# EAGLE schematic ultrasonic_anemometer_pcb (EAGLE 7.7.0)
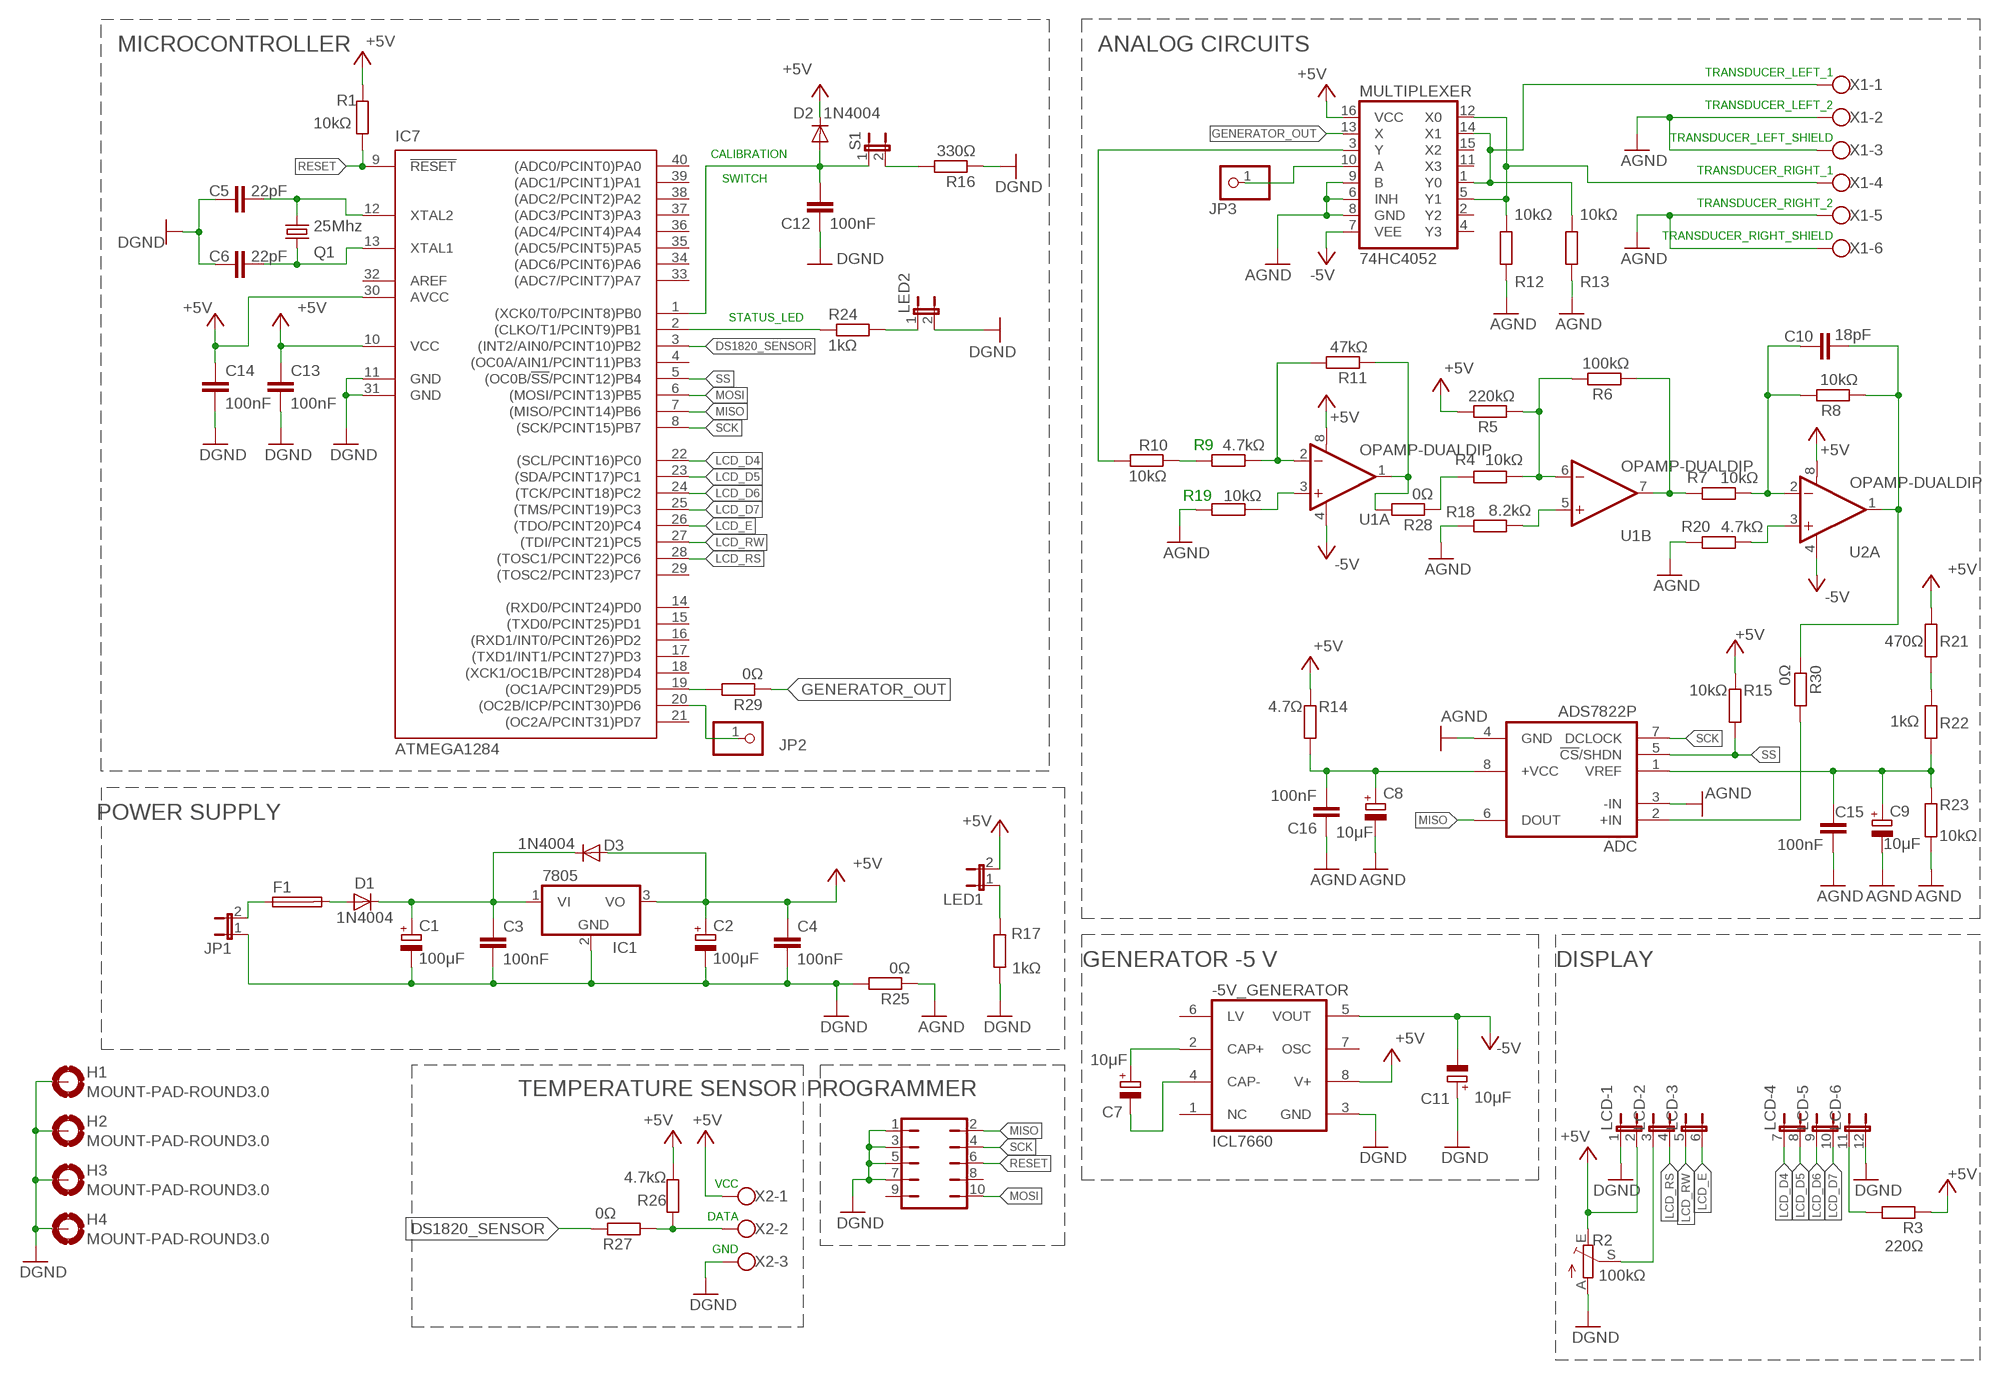
[diagram p0: schematic, sheet 1]

## Parts
-5V_GENERATOR  ICL7660  ICL7660CPA  [DIL08]
ADC  ADS7822P  ADS7816P  [DIL08]
C1  100μF  CPOL-EUE2.5-5  [E2,5-5]
C2  100μF  CPOL-EUE2.5-5  [E2,5-5]
C3  100nF  C-EU025-025X050  [C025-025X050]
C4  100nF  C-EU025-025X050  [C025-025X050]
C5  22pF  C-EU050-024X044  [C050-024X044]
C6  22pF  C-EU050-024X044  [C050-024X044]
C7  10μF  CPOL-EUE2.5-5  [E2,5-5]
C8  10μF  CPOL-EUE2.5-5  [E2,5-5]
C9  10μF  CPOL-EUE2.5-5  [E2,5-5]
C10  18pF  C-EU050-024X044  [C050-024X044]
C11  10μF  CPOL-EUE2.5-5  [E2,5-5]
C12  100nF  C-EU025-025X050  [C025-025X050]
C13  100nF  C-EU025-025X050  [C025-025X050]
C14  100nF  C-EU025-025X050  [C025-025X050]
C15  100nF  C-EU025-025X050  [C025-025X050]
C16  100nF  C-EU025-025X050  [C025-025X050]
D1  1N4004  [DO41-10]
D2  1N4004  [DO41-10]
D3  1N4004  [DO41-10]
F1  SH22,5A  [SH22,5A]
H1  MOUNT-PAD-ROUND3.0  [3,0-PAD]
H2  MOUNT-PAD-ROUND3.0  [3,0-PAD]
H3  MOUNT-PAD-ROUND3.0  [3,0-PAD]
H4  MOUNT-PAD-ROUND3.0  [3,0-PAD]
IC1  7805  7805TV  [TO220V]
IC7  ATMEGA1284  MEGA164P/324P/644P-PU  [DIL40]
JP1  JP1E  [JP1]
JP2  PINHD-1X1  [1X01]
JP3  PINHD-1X1  [1X01]
LCD  JP6QE  [JP6Q]
LED1  JP1E  [JP1]
LED2  JP1E  [JP1]
MULTIPLEXER  74HC4052  74HC4052DIP  [DIL16]
PROGRAMMER  JP5Q  [JP5Q]
Q1  25Mhz  CRYSTALHC49S  [HC49/S]
R1  10kΩ  R-EU_0207/10  [0207/10]
R2  100kΩ  TRIM_EU-CA6V  [CA6V]
R3  220Ω  R-EU_0207/10  [0207/10]
R4  10kΩ  R-EU_0207/10  [0207/10]
R5  220kΩ  R-EU_0207/10  [0207/10]
R6  100kΩ  R-EU_0207/10  [0207/10]
R7  10kΩ  R-EU_0207/10  [0207/10]
R8  10kΩ  R-EU_0207/10  [0207/10]
R9  4.7kΩ  R-EU_0207/10  [0207/10]
R10  10kΩ  R-EU_0207/10  [0207/10]
R11  47kΩ  R-EU_0207/10  [0207/10]
R12  10kΩ  R-EU_0207/10  [0207/10]
R13  10kΩ  R-EU_0207/10  [0207/10]
R14  4.7Ω  R-EU_0207/10  [0207/10]
R15  10kΩ  R-EU_0207/10  [0207/10]
R16  330Ω  R-EU_0207/10  [0207/10]
R17  1kΩ  R-EU_0207/10  [0207/10]
R18  8.2kΩ  R-EU_0207/10  [0207/10]
R19  10kΩ  R-EU_0207/10  [0207/10]
R20  4.7kΩ  R-EU_0207/10  [0207/10]
R21  470Ω  R-EU_0207/10  [0207/10]
R22  1kΩ  R-EU_0207/10  [0207/10]
R23  10kΩ  R-EU_0207/10  [0207/10]
R24  1kΩ  R-EU_0207/10  [0207/10]
R25  0Ω  R-EU_0207/10  [0207/10]
R26  4.7kΩ  R-EU_0207/10  [0207/10]
R27  0Ω  R-EU_0207/10  [0207/10]
R28  0Ω  R-EU_0207/10  [0207/10]
R29  0Ω  R-EU_0207/10  [0207/10]
R30  0Ω  R-EU_0207/10  [0207/10]
S1  JP1E  [JP1]
U1  OPAMP-DUALDIP  [DIP08]
U2  OPAMP-DUALDIP  [DIP08]
X1  W237-6  [W237-6]
X2  W237-103  [W237-103]

## Nets
-5V: -5V_GENERATOR.5(VOUT) C11.- MULTIPLEXER.7(VEE) U1.4(A:V-) U2.4(A:V-)
ADADDDADAD: R26.2 R27.1 X2.2
AGND: ADC.3(-IN) ADC.4(GND) C8.- C9.- C15.1 C16.2 MULTIPLEXER.6(INH) MULTIPLEXER.8(GND) MULTIPLEXER.9(B) R12.2 R13.2 R18.2 R19.2 R20.2 R23.2 R25.1 X1.2 X1.3 X1.5 X1.6
DS1820_SENSOR: IC7.3((INT2/AIN0/PCINT10)PB2) R27.2
GENERATOR_OUT: MULTIPLEXER.13(X) R29.1
GND: -5V_GENERATOR.3(GND) C1.- C2.- C3.2 C4.2 C5.1 C6.1 C11.+ C12.2 C13.2 C14.2 H1.B3,0(MOUNT) H2.B3,0(MOUNT) H3.B3,0(MOUNT) H4.B3,0(MOUNT) IC1.2(GND) IC7.11(GND) IC7.31(GND) JP1.1 LCD.1 LCD.12 LED2.2 PROGRAMMER.1 PROGRAMMER.3 PROGRAMMER.5 PROGRAMMER.7 R2.A R16.1 R17.2 R25.2 X2.3 ; supply symbol labelled DGND
LCD_D4: IC7.22((SCL/PCINT16)PC0) LCD.7
LCD_D5: IC7.23((SDA/PCINT17)PC1) LCD.8
LCD_D6: IC7.24((TCK/PCINT18)PC2) LCD.9
LCD_D7: IC7.25((TMS/PCINT19)PC3) LCD.10
LCD_E: IC7.26((TDO/PCINT20)PC4) LCD.6
LCD_RS: IC7.28((TOSC1/PCINT22)PC6) LCD.4
LCD_RW: IC7.27((TDI/PCINT21)PC5) LCD.5
MISO: ADC.6(DOUT) IC7.7((MISO/PCINT14)PB6) PROGRAMMER.2
MOSI: IC7.6((MOSI/PCINT13)PB5) PROGRAMMER.10
N$1: F1.1 JP1.2
N$2: D1.A F1.2
N$3: C1.+ C3.1 D1.C D3.C IC1.1(VI)
N$4: MULTIPLEXER.1(Y0) MULTIPLEXER.14(X1) R13.1 X1.1
N$5: MULTIPLEXER.5(Y1) MULTIPLEXER.12(X0) R12.1 X1.4
N$6: R9.1 R11.2 U1.2(A:-IN)
N$7: R19.1 U1.3(A:+IN)
N$8: R18.1 U1.5(B:+IN)
N$9: R20.1 U2.3(A:+IN)
N$10: C12.1 D2.A IC7.1((XCK0/T0/PCINT8)PB0) S1.1
N$11: C5.2 IC7.12(XTAL2) Q1.2
N$12: C6.2 IC7.13(XTAL1) Q1.1
N$13: C10.2 R7.1 R8.2 U2.2(A:-IN)
N$14: -5V_GENERATOR.2(CAP+) C7.+
N$15: -5V_GENERATOR.4(CAP-) C7.-
N$16: R9.2 R10.2
N$17: R4.1 R5.1 R6.2 U1.6(B:-IN)
N$18: R6.1 R7.2 U1.7(B:OUT)
N$19: LCD.11 R3.2
N$20: R16.2 S1.2
N$21: LCD.3 R2.S
N$22: ADC.1(VREF) C9.+ C15.2 R22.2 R23.1
N$23: LED2.1 R24.2
N$24: LED1.1 R17.1
N$25: ADC.8(+VCC) C8.+ C16.1 R14.2
N$26: C10.1 R8.1 R30.1 U2.1(A:OUT)
N$27: IC7.19((OC1A/PCINT29)PD5) R29.2
N$29: R21.2 R22.1
N$30: ADC.2(+IN) R30.2
N$31: IC7.2((CLKO/T1/PCINT9)PB1) R24.1
N$32: R4.2 R28.1
N$33: R11.1 R28.2 U1.1(A:OUT)
N$34: MULTIPLEXER.3(Y) R10.1
N$35: IC7.20((OC2B/ICP/PCINT30)PD6) JP2.1
RESET: IC7.9(!RESET) PROGRAMMER.6 R1.2
SCK: ADC.7(DCLOCK) IC7.8((SCK/PCINT15)PB7) PROGRAMMER.4
SS: ADC.5(!CS!/SHDN) IC7.5((OC0B/!SS!/PCINT12)PB4) R15.2
SWITCH_CHANNEL: JP3.1 MULTIPLEXER.10(A)
VCC: -5V_GENERATOR.8(V+) C2.+ C4.1 C13.1 C14.1 D2.C D3.A IC1.3(VO) IC7.10(VCC) IC7.30(AVCC) LCD.2 LED1.2 MULTIPLEXER.16(VCC) R1.1 R2.E R3.1 R5.2 R14.1 R15.1 R21.1 R26.1 U1.8(A:V+) U2.8(A:V+) X2.1 ; supply symbol labelled +5V
Unconnected: -5V_GENERATOR.1(NC) -5V_GENERATOR.6(LV) -5V_GENERATOR.7(OSC) IC7.4((OC0A/AIN1/PCINT11)PB3) IC7.14((RXD0/PCINT24)PD0) IC7.15((TXD0/PCINT25)PD1) IC7.16((RXD1/INT0/PCINT26)PD2) IC7.17((TXD1/INT1/PCINT27)PD3) IC7.18((XCK1/OC1B/PCINT28)PD4) IC7.21((OC2A/PCINT31)PD7) IC7.29((TOSC2/PCINT23)PC7) IC7.33((ADC7/PCINT7)PA7) IC7.34((ADC6/PCINT6)PA6) IC7.35((ADC5/PCINT5)PA5) IC7.36((ADC4/PCINT4)PA4) IC7.37((ADC3/PCINT3)PA3) IC7.38((ADC2/PCINT2)PA2) IC7.39((ADC1/PCINT1)PA1) IC7.40((ADC0/PCINT0)PA0) MULTIPLEXER.2(Y2) MULTIPLEXER.4(Y3) MULTIPLEXER.11(X3) MULTIPLEXER.15(X2) PROGRAMMER.8 PROGRAMMER.9 U2.5(B:+IN) U2.6(B:-IN) U2.7(B:OUT)

## Notes on the sheet
- MICROCONTROLLER | ANALOG CIRCUITS
- TRANSDUCER_LEFT_1
- TRANSDUCER_LEFT_2
- TRANSDUCER_LEFT_SHIELD
- CALIBRATION
- TRANSDUCER_RIGHT_1
- SWITCH
- TRANSDUCER_RIGHT_2
- TRANSDUCER_RIGHT_SHIELD
- STATUS_LED
- POWER SUPPLY
- GENERATOR -5 V | DISPLAY
- TEMPERATURE SENSOR | PROGRAMMER
- VCC
- DATA
- GND

## Power pins joined to a net without a drawn wire
AREF: IC7.32(AREF)

## Library data of the parts
-5V_GENERATOR = maxim:ICL7660CPA: VOLTAGE CONVERTER; MF: INTERSIL; MPN: ICL7660CPA; OC_FARNELL: 1018170; OC_NEWARK: 06F7441
ADC = burr-brown:ADS7816: 12-Bit High Speed Micro Power Sampling ADC; MF: TEXAS INSTRUMENT CONNECTORS; MPN: ADS7816P; OC_FARNELL: 1097576; OC_NEWARK: 14M9332
C1 C2 C7-C9 C11 = rcl:CPOL-EU: POLARIZED CAPACITOR, European symbol
C3-C6 C10 C12-C16 = rcl:C-EU: CAPACITOR, European symbol
D1-D3 = adafruit:1N4004: DIODE General purpose 1N400x type rectifier (With bigger pads) http://www.ladyada.net/library/pcb/eaglelibrary.html
F1 = fuse:SH22,5A: FUSE HOLDER grid 22,5mm, isolated cap OGN0031 8201, Schurter (Buerklin); MPN: 0031.7701.11; OC_FARNELL: unknown; OC_NEWARK: 04F1224
H1-H4 = holes:MOUNT-PAD-ROUND: MOUNTING PAD, round
IC1 = linear:78*: Positive VOLTAGE REGULATOR Source: http://cache.national.com/ds/LM/LM78L05.pdf http://www.fairchildsemi.com/ds/LM/LM7805.pdf
IC7 = avr-7:MEGA164P/324P/644P-PU
JP1 LED1 LED2 S1 = jumper:JP1E: JUMPER
JP2 JP3 = pinhead:PINHD-1X1: PIN HEADER
LCD = jumper:JP6QE: JUMPER
MULTIPLEXER = SparkFun-AnalogIC:74HC4052: Dual 4:1 analog mux
PROGRAMMER = jumper:JP5Q: JUMPER
Q1 = crystal:CRYSTAL: CRYSTAL; OC_FARNELL: 1667008; OC_NEWARK: unknown
R1 R3-R30 = rcl:R-EU_: RESISTOR, European symbol
R2 = pot:TRIM_EU-: POTENTIOMETER
U1 U2 = SparkFun-AnalogIC:OPAMP-DUAL: Generic op-amp footprint
X1 = con-wago-500:W237-6: WAGO SCREW CLAMP; OC_FARNELL: unknown; OC_NEWARK: unknown
X2 = con-wago-500:W237-103: WAGO SCREW CLAMP; MPN: 237-103; OC_FARNELL: unknown; OC_NEWARK: 18M7116